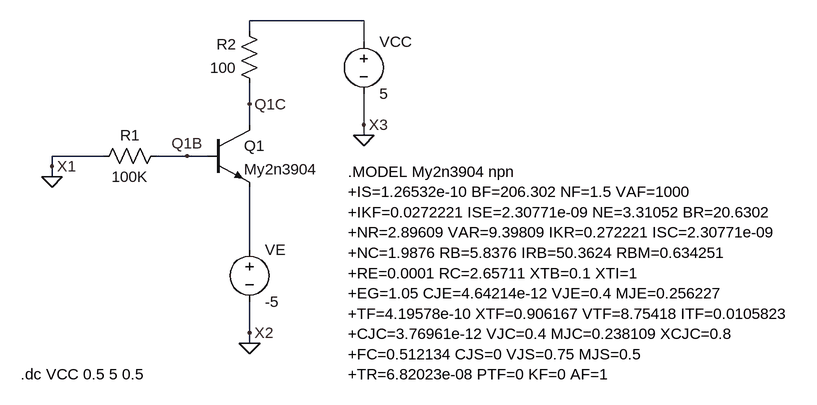
[diagram p0: schematic project1_p1.asc]
project1_p1.asc, the LTspice schematic file:
Version 4
SHEET 1 1136 680
WIRE 416 -64 240 -64
WIRE 240 -48 240 -64
WIRE 416 -32 416 -64
WIRE 240 64 240 32
WIRE 240 96 240 64
WIRE 416 96 416 48
WIRE 416 112 416 96
WIRE 16 144 -64 144
WIRE 144 144 96 144
WIRE 176 144 144 144
WIRE -64 160 -64 144
WIRE -64 176 -64 160
WIRE 240 288 240 192
WIRE 240 416 240 368
WIRE 240 432 240 416
FLAG -64 176 0
FLAG 416 112 0
FLAG 240 432 0
FLAG 144 144 Q1B
FLAG 240 416 X2
FLAG -64 160 X1
FLAG 416 96 X3
FLAG 240 64 Q1C
SYMBOL npn 176 96 R0
SYMATTR InstName Q1
SYMATTR Value My2n3904
SYMBOL res 112 128 R90
WINDOW 0 0 56 VBottom 2
WINDOW 3 32 56 VTop 2
SYMATTR InstName R1
SYMATTR Value 100K
SYMBOL res 256 48 R180
WINDOW 0 36 76 Left 2
WINDOW 3 36 40 Left 2
SYMATTR InstName R2
SYMATTR Value 100
SYMBOL voltage 240 272 R0
WINDOW 123 0 0 Left 0
WINDOW 39 0 0 Left 0
SYMATTR InstName VE
SYMATTR Value -5
SYMBOL voltage 416 -48 R0
WINDOW 123 0 0 Left 0
WINDOW 39 0 0 Left 0
SYMATTR InstName VCC
SYMATTR Value 5
TEXT 392 168 Left 2 !.MODEL My2n3904 npn\n+IS=1.26532e-10 BF=206.302 NF=1.5 VAF=1000\n+IKF=0.0272221 ISE=2.30771e-09 NE=3.31052 BR=20.6302\n+NR=2.89609 VAR=9.39809 IKR=0.272221 ISC=2.30771e-09\n+NC=1.9876 RB=5.8376 IRB=50.3624 RBM=0.634251\n+RE=0.0001 RC=2.65711 XTB=0.1 XTI=1\n+EG=1.05 CJE=4.64214e-12 VJE=0.4 MJE=0.256227\n+TF=4.19578e-10 XTF=0.906167 VTF=8.75418 ITF=0.0105823\n+CJC=3.76961e-12 VJC=0.4 MJC=0.238109 XCJC=0.8\n+FC=0.512134 CJS=0 VJS=0.75 MJS=0.5\n+TR=6.82023e-08 PTF=0 KF=0 AF=1
TEXT -112 480 Left 2 !.dc VCC 0.5 5 0.5

The netlist it stands for:
* project1_p1.asc
Q1 Q1C Q1B N002 0 My2n3904
R1 Q1B 0 100K
R2 Q1C N001 100
VE N002 0 -5
VCC N001 0 5
.model NPN NPN
.model PNP PNP
.lib standard.bjt
.MODEL My2n3904 npn
+IS=1.26532e-10 BF=206.302 NF=1.5 VAF=1000
+IKF=0.0272221 ISE=2.30771e-09 NE=3.31052 BR=20.6302
+NR=2.89609 VAR=9.39809 IKR=0.272221 ISC=2.30771e-09
+NC=1.9876 RB=5.8376 IRB=50.3624 RBM=0.634251
+RE=0.0001 RC=2.65711 XTB=0.1 XTI=1
+EG=1.05 CJE=4.64214e-12 VJE=0.4 MJE=0.256227
+TF=4.19578e-10 XTF=0.906167 VTF=8.75418 ITF=0.0105823
+CJC=3.76961e-12 VJC=0.4 MJC=0.238109 XCJC=0.8
+FC=0.512134 CJS=0 VJS=0.75 MJS=0.5
+TR=6.82023e-08 PTF=0 KF=0 AF=1
.dc VCC 0.5 5 0.5
.backanno
.end